# Altium project newlock.PrjPcb
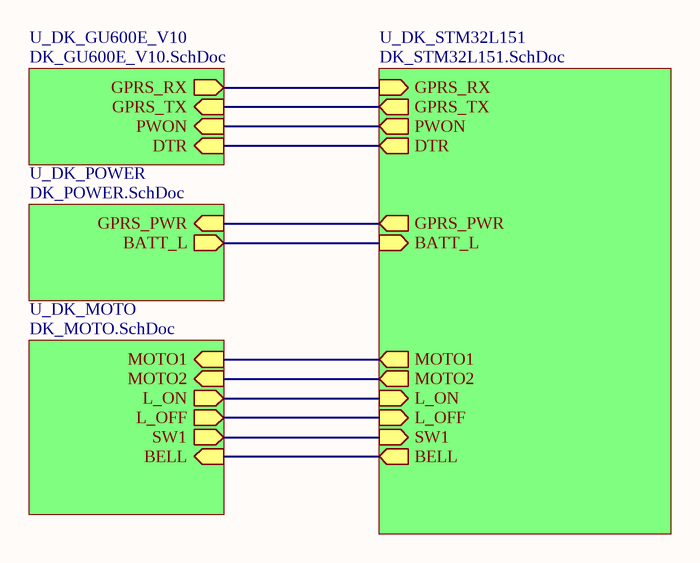
[diagram p0: main.SchDoc]
5 sheets, 86 parts. Net scope: hierarchical (ports join the sheet entries above them; power ports are global).
Board file: DK_LOCK_V1.0.PcbDoc
Sheets:
  main.SchDoc
    U_DK_STM32L151 = DK_STM32L151.SchDoc
    U_DK_POWER = DK_POWER.SchDoc
    U_DK_MOTO = DK_MOTO.SchDoc
    U_DK_GU600E_V10 = DK_GU600E_V10.SchDoc

## Sheet main.SchDoc
size A4

### Sub-sheets
U_DK_GU600E_V10 = DK_GU600E_V10.SchDoc: GPRS_RX (out), GPRS_TX (in), PWON (in), DTR (in)
U_DK_MOTO = DK_MOTO.SchDoc: MOTO1 (in), MOTO2 (in), L_OFF (out), L_ON (out), SW1 (out), BELL (in)
U_DK_POWER = DK_POWER.SchDoc: GPRS_PWR (in), BATT_L (out)
U_DK_STM32L151 = DK_STM32L151.SchDoc: GPRS_TX (out), GPRS_RX (in), PWON (out), GPRS_PWR (out), MOTO1 (out), MOTO2 (out), BATT_L (in), L_ON (in), L_OFF (in), SW1 (in), DTR (out), BELL (out)

### Nets
GPRS_PWR: sheet U_DK_STM32L151/GPRS_PWR, sheet U_DK_POWER/GPRS_PWR
L_OFF: sheet U_DK_STM32L151/L_OFF, sheet U_DK_MOTO/L_OFF
L_ON: sheet U_DK_STM32L151/L_ON, sheet U_DK_MOTO/L_ON
MOTO1: sheet U_DK_STM32L151/MOTO1, sheet U_DK_MOTO/MOTO1
MOTO2: sheet U_DK_STM32L151/MOTO2, sheet U_DK_MOTO/MOTO2
PWON: sheet U_DK_STM32L151/PWON, sheet U_DK_GU600E_V10/PWON
SW1: sheet U_DK_STM32L151/SW1, sheet U_DK_MOTO/SW1
NetR4_1: sheet U_DK_STM32L151/GPRS_TX, sheet U_DK_GU600E_V10/GPRS_TX
NetR5_1: sheet U_DK_STM32L151/GPRS_RX, sheet U_DK_GU600E_V10/GPRS_RX
NetR6_1: sheet U_DK_STM32L151/BATT_L, sheet U_DK_POWER/BATT_L
NetR25_1: sheet U_DK_STM32L151/BELL, sheet U_DK_MOTO/BELL
NetU1_44: sheet U_DK_STM32L151/DTR, sheet U_DK_GU600E_V10/DTR

## Sheet DK_STM32L151.SchDoc: lock
size A4; Author: george; Revision: V1.0; SheetNumber: 1
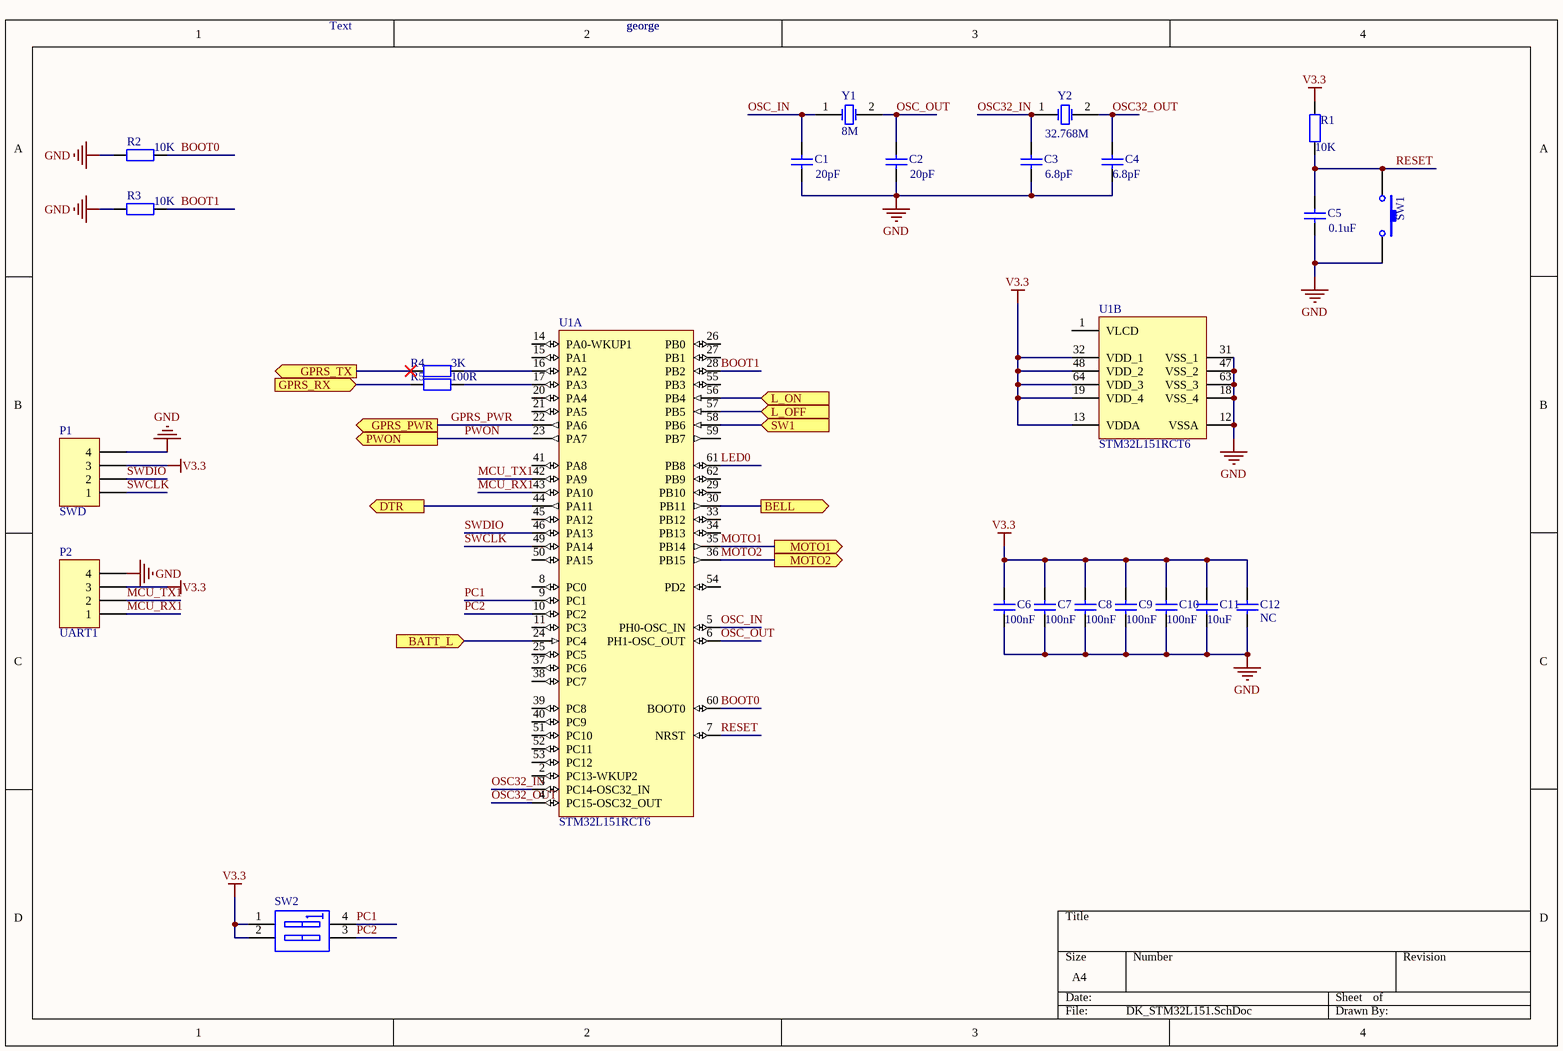
[diagram p1: DK_STM32L151.SchDoc]

### Parts
C1  value 20pF  [0603]  (hidden comment: Cap)
C2  value 20pF  [0603]  (hidden comment: Cap)
C3  value 6.8pF  [0603]  (hidden comment: Cap)
C4  value 6.8pF  [0603]  (hidden comment: Cap)
C5  value 0.1uF  [0603]  (hidden comment: Cap)
C6  value 100nF  [0603]  (hidden comment: Cap)
C7  value 100nF  [0603]  (hidden comment: Cap)
C8  value 100nF  [0603]  (hidden comment: Cap)
C9  value 100nF  [0603]  (hidden comment: Cap)
C10  value 100nF  [0603]  (hidden comment: Cap)
C11  value 10uF  [0603]  (hidden comment: Cap)
C12  NC  [0603]
P1  SWD  [HDR1X4]
P2  UART1  [HDR1X4]
R1  value 10K  [0603]  (hidden comment: Res2)
R2  value 10K  [0603]  (hidden comment: Res2)
R3  value 10K  [0603]  (hidden comment: Res2)
R4  value 3K  [0603]  (hidden comment: Res2)
R5  value 100R  [0603]  (hidden comment: Res2)
SW1  SW-PB  [3*6*4.3]  (value not drawn)
SW2  SW DIP-2  [SW-2*4]  (value not drawn)
U1  STM32L151RCT6  [LQFP64]  (parts A,B of 2)
Y1  8M  [SMT-OSC]
Y2  32.768M  [XTAL32.786]

### Ports
BATT_L (in), BELL (out), DTR (out), GPRS_PWR (out), GPRS_RX (in), GPRS_TX (out), L_OFF (in), L_ON (in), MOTO1 (out), MOTO2 (out), PWON (out), SW1 (in)

### Nets
GND: C1.1 C2.1 C3.1 C4.1 C5.2 C6.1 C7.1 C8.1 C9.1 C10.1 C11.1 C12.1 P1.4 P2.4 R2.1 R3.1 SW1.2 U1.12(VSSA) U1.18(VSS_4) U1.31(VSS_1) U1.47(VSS_2) U1.63(VSS_3)
V3.3: C6.2 C7.2 C8.2 C9.2 C10.2 C11.2 C12.2 P1.3 P2.3 R1.1 SW2.1(A1) SW2.2(A2) U1.13(VDDA) U1.19(VDD_4) U1.32(VDD_1) U1.48(VDD_2) U1.64(VDD_3)
BOOT0: R2.2 U1.60(BOOT0)
BOOT1: R3.2 U1.28(PB2)
GPRS_PWR: U1.22(PA6) ; port GPRS_PWR
L_OFF: U1.57(PB5) ; port L_OFF
L_ON: U1.56(PB4) ; port L_ON
LED0: U1.61(PB8)
MCU_RX1: P2.1 U1.43(PA10)
MCU_TX1: P2.2 U1.42(PA9)
MOTO1: U1.35(PB14) ; port MOTO1
MOTO2: U1.36(PB15) ; port MOTO2
OSC32_IN: C3.2 U1.3(PC14-OSC32_IN) Y2.1(OSC1)
OSC32_OUT: C4.2 U1.4(PC15-OSC32_OUT) Y2.2(OSC2)
OSC_IN: C1.2 U1.5(PH0-OSC_IN) Y1.1(OSC1)
OSC_OUT: C2.2 U1.6(PH1-OSC_OUT) Y1.2(OSC2)
PC1: SW2.4(B1) U1.9(PC1)
PC2: SW2.3(B2) U1.10(PC2)
PWON: U1.23(PA7) ; port PWON
RESET: C5.1 R1.2 SW1.1 U1.7(NRST)
SW1: U1.58(PB6) ; port SW1
SWCLK: P1.1 U1.49(PA14)
SWDIO: P1.2 U1.46(PA13)
NetR4_1: R4.1 ; port GPRS_TX
NetR4_2: R4.2 U1.16(PA2)
NetR5_1: R5.1 ; port GPRS_RX
NetR5_2: R5.2 U1.17(PA3)
NetR6_1: U1.24(PC4) ; port BATT_L
NetR25_1: U1.30(PB11) ; port BELL
NetU1_44: U1.44(PA11) ; port DTR

Not connected (* = marked no-connect by the designer): U1 1(VLCD) 2(PC13-WKUP2) 8(PC0) 11(PC3) 14(PA0-WKUP1) 15(PA1) 20(PA4) 21(PA5) 25(PC5) 26(PB0) 27(PB1) 29(PB10) 33(PB12) 34(PB13) 37(PC6) 38(PC7) 39(PC8) 40(PC9) 41(PA8) 45(PA12) 50(PA15) 51(PC10) 52(PC11) 53(PC12) 54(PD2) 55(PB3) 59(PB7) 62(PB9)

### Notes on the sheet
- Text

### Library data of the parts
C1-C11 = Cap: Capacitor; Published: 8-Jun-2000; LatestRevisionDate: 17-Jul-2002; LatestRevisionNote: Re-released for DXP Platform.; PackageReference: RAD-0.3; Publisher: Altium Limited; PackageDescription: Radial Cap, Thru-Hole; 2 Leads; 0.3 in Pin Spacing
C12 = Cap: Capacitor; Value: 10uF; Published: 8-Jun-2000; LatestRevisionDate: 17-Jul-2002; LatestRevisionNote: Re-released for DXP Platform.; PackageReference: RAD-0.3; Publisher: Altium Limited; PackageDescription: Radial Cap, Thru-Hole; 2 Leads; 0.3 in Pin Spacing
P1 P2 = Header 4: Header, 4-Pin; LatestRevisionDate: 17-Jul-2002; LatestRevisionNote: Re-released for DXP Platform.; Publisher: Altium Limited
R1-R5 = Res2: Resistor; Published: 8-Jun-2000; LatestRevisionDate: 17-Jul-2002; LatestRevisionNote: Re-released for DXP Platform.; PackageReference: AXIAL-0.4; Publisher: Altium Limited; PackageDescription: Axial Device, Thru-Hole; 2 Leads; 0.4 in Pin Spacing
SW1 = SW-PB: Switch; Published: 24-Mar-1999; LatestRevisionDate: 17-Jul-2002; LatestRevisionNote: Re-released for DXP Platform.; PackageReference: SPST-2; Publisher: Altium Limited; PackageDescription: Switch; 2 Leads
SW2 = SW DIP-2: DIP Switch, 2 Position, SPST; Published: 24-Mar-1999; LatestRevisionDate: 17-Jul-2002; LatestRevisionNote: Re-released for DXP Platform.; PackageReference: DIP-4; Publisher: Altium Limited
U1 = STM32L151RCT6: ARM Cortex-M3 32-bit MCU, 256 KB Flash, 32 KB Internal RAM, 51 I/Os, 64-pin LQFP, -40 to 85 degC, Tray; Manufacturer: STMicroelectronics; D/A Converter: 2x12-bit (2 Channel); Data E2PROM nom (B): 8192; FLASH Size (Prog) (kB): 256; I/Os (High Current): 51; Internal RAM Size (kB): 32; Supply Voltage(Vcc) min (V): 1.65; DatasheetVersion: Rev. 3; PackageVersion: Rev. 4, 06/2013; PackageReference: LQFP64; PackageDescription: 64-Pin Low Profile Quad Flat Package, 10 x 10 mm Body, 0.5 mm Pitch; Core: ARM Cortex-M3; Operating Frequency(F) (Processor speed) (MHz): 32; Packing: Tray; Mounting Technology: Surface Mount; PartNumber: STM32L151RCT6; ComponentLink1Description: Manufacturer URL; ComponentLink1URL: http://www.st.com/web/en/home.html; ComponentLink2Description: Datasheet; ComponentLink2URL: http://www.st.com/st-web-ui/static/active/en/resource/technical/document/datasheet/DM00048356.pdf; ComponentLink3Description: Package Specification; ComponentLink3URL: http://www.st.com/st-web-ui/static/active/en/resource/technical/document/datasheet/DM00037051.pdf
Y1 Y2 = XTAL: Crystal Oscillator; Published: 8-Jun-2000; LatestRevisionDate: 17-Jul-2002; LatestRevisionNote: Re-released for DXP Platform.; PackageReference: R38; Publisher: Altium Limited; PackageDescription: Crystal, Thru-Hole; 2 Leads; Body 3.1 x 8.2 mm (Dia.xH)

## Sheet DK_POWER.SchDoc
size A4
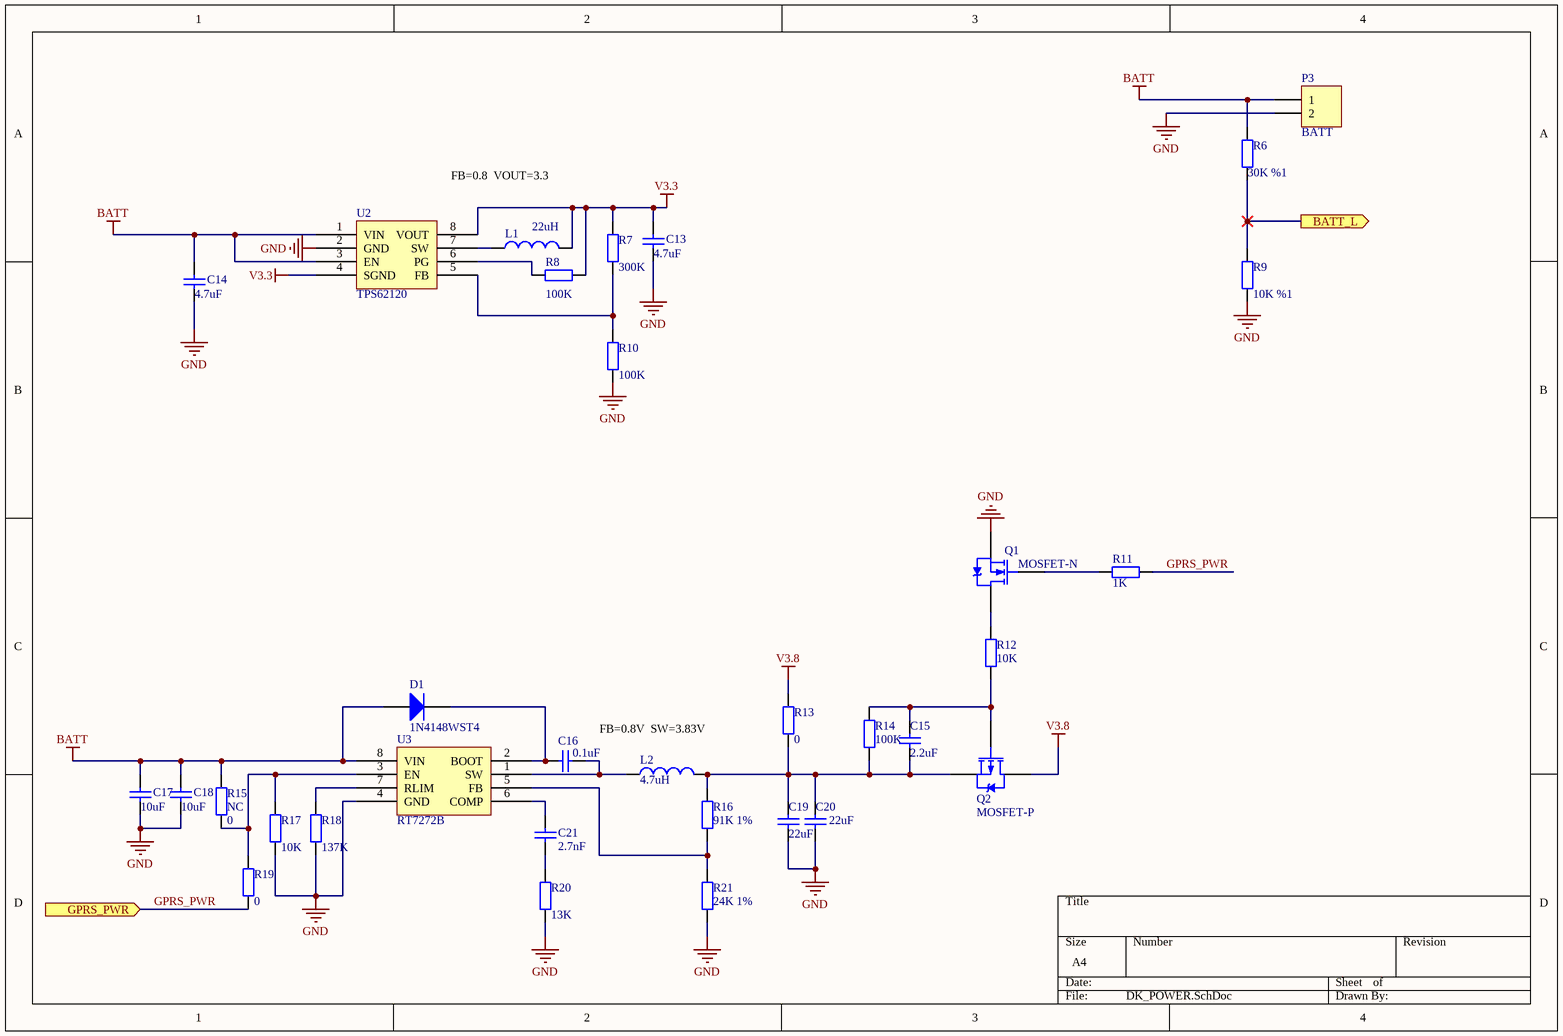
[diagram p2: DK_POWER.SchDoc]

### Parts
C13  value 4.7uF  [0603]  (hidden comment: Cap)
C14  value 4.7uF  [0603]  (hidden comment: Cap)
C15  value 2.2uF  [0603]  (hidden comment: Cap)
C16  value 0.1uF  [0603]  (hidden comment: Cap)
C17  value 10uF  [0603]  (hidden comment: Cap)
C18  value 10uF  [0603]  (hidden comment: Cap)
C19  value 22uF  [0603]  (hidden comment: Cap)
C20  value 22uF  [0603]  (hidden comment: Cap)
C21  value 2.7nF  [0603]  (hidden comment: Cap)
D1  1N4148WST4  [SOD-323]
L1  value 22uH  [0630]  (hidden comment: Inductor)
L2  value 4.7uH  [0630]  (hidden comment: Inductor)
P3  BATT  [HEAD2L-0.8]
Q1  MOSFET-N  [SOT-23A]
Q2  MOSFET-P  [SOT-23A]
R6  value 30K %1  [0603]  (hidden comment: Res2)
R7  value 300K  [0603]  (hidden comment: Res2)
R8  value 100K  [0603]  (hidden comment: Res2)
R9  value 10K %1  [0603]  (hidden comment: Res2)
R10  value 100K  [0603]  (hidden comment: Res2)
R11  value 1K  [0603]  (hidden comment: Res2)
R12  value 10K  [0603]  (hidden comment: Res2)
R13  value 0  [0603]  (hidden comment: NC)
R14  value 100K  [0603]  (hidden comment: Res2)
R15  NC  value 0  [0603]
R16  value 91K 1%  [0603]  (hidden comment: Res2)
R17  value 10K  [0603]  (hidden comment: Res2)
R18  value 137K  [0603]  (hidden comment: Res2)
R19  value 0  [0603]  (hidden comment: Res2)
R20  value 13K  [0603]  (hidden comment: Res2)
R21  value 24K 1%  [0603]  (hidden comment: Res2)
U2  TPS62120  [TPS62120]
U3  RT7272B  [RT7272B]

### Ports
BATT_L (out), GPRS_PWR (in)

### Nets
BATT: C14.2 C17.2 C18.2 D1.1(A) P3.1 R6.2 R15.2 U2.1(VIN) U2.3(EN) U3.8(VIN)
GND: C13.1 C14.1 C17.1 C18.1 C19.1 C20.1 P3.2 Q1.3(S) R9.2 R10.1 R17.1 R18.1 R20.1 R21.1 U2.2(GND) U3.4(GND)
V3.3: C13.2 L1.2 R7.2 R8.2 U2.4(SGND) U2.8(VOUT)
V3.8: Q2.2(D) R13.2
GPRS_PWR: R11.2 R19.1 ; port GPRS_PWR
NetC15_1: C15.1 C19.2 C20.2 L2.2 Q2.3(S) R13.1 R14.1 R16.2
NetC15_2: C15.2 Q2.1(G) R12.1 R14.2
NetC16_1: C16.1 L2.1 U3.1(SW)
NetC16_2: C16.2 D1.2(K) U3.2(BOOT)
NetC21_1: C21.1 U3.6(COMP)
NetC21_2: C21.2 R20.2
NetL1_1: L1.1 U2.7(SW)
NetQ1_1: Q1.1(G) R11.1
NetQ1_2: Q1.2(D) R12.2
NetR6_1: R6.1 R9.1 ; port BATT_L
NetR7_1: R7.1 R10.2 U2.5(FB)
NetR8_1: R8.1 U2.6(PG)
NetR15_1: R15.1 R17.2 R19.2 U3.3(EN)
NetR16_1: R16.1 R21.2 U3.5(FB)
NetR18_2: R18.2 U3.7(RLIM)

### Notes on the sheet
- FB=0.8  VOUT=3.3
- FB=0.8V  SW=3.83V

### Library data of the parts
C13-C21 = Cap: Capacitor; Published: 8-Jun-2000; LatestRevisionDate: 17-Jul-2002; LatestRevisionNote: Re-released for DXP Platform.; PackageReference: RAD-0.3; Publisher: Altium Limited; PackageDescription: Radial Cap, Thru-Hole; 2 Leads; 0.3 in Pin Spacing
D1 = Diode: Default Diode; Published: 8-Jun-2000; LatestRevisionDate: 17-Jul-2002; LatestRevisionNote: Re-released for DXP Platform.; PackageVersion: Sep-1996; PackageReference: SMC; Publisher: Altium Limited; PackageDescription: DO-214-AB/SMC; 2 C-Bend Leads; Body 7.9 x 5.9 mm, inc. leads (LxW); Code_JEDEC: DO-214-AB
L1 L2 = Inductor: Code_IEC: 1005; Published: 8-Jun-2000; LatestRevisionDate: 29-May-2009; LatestRevisionNote: IPC-7351 Footprint Added.; PackageReference: 0402-A; Publisher: Altium Limited; PackageDescription: Chip Inductor; Code_JEITA: 0402
P3 = Header 2: Header, 2-Pin; LatestRevisionDate: 17-Jul-2002; LatestRevisionNote: Re-released for DXP Platform.; Publisher: Altium Limited
Q1 = NMOS-2: N-Channel Power MOSFET; Note: Pin 2 is electrically connected to pin 4.; Published: 8-Jun-2000; LatestRevisionDate: 17-Jul-2002; LatestRevisionNote: Re-released for DXP Platform.; DatasheetVersion: PD-9.814; PackageVersion: Feb-1997; PackageReference: TO-220AB; Publisher: Altium Limited; PackageDescription: TO, Thru-Hole, Vertical, Heatsink Mounted; 3 In-Line Leads; Pitch 2.54 mm; ComponentLink1Description: Manufacturer Link; ComponentLink1URL: http://www.irf.com/
Q2 = PMOS-2: P-Channel Power MOSFET; Note: Pin 4 not drawn and electrically connected to Pin 2.; Published: 8-Jun-2000; LatestRevisionDate: 17-Jul-2002; LatestRevisionNote: Re-released for DXP Platform.; DatasheetVersion: PD-9.390D; PackageVersion: Feb-1997; PackageReference: TO-220AB; Publisher: Altium Limited; PackageDescription: TO, Thru-Hole, Vertical, Heatsink Mounted; 3 In-Line Leads; Pitch 2.54 mm; ComponentLink1Description: Manufacturer Link; ComponentLink1URL: http://www.irf.com/
R6-R21 = Res2: Resistor; Published: 8-Jun-2000; LatestRevisionDate: 17-Jul-2002; LatestRevisionNote: Re-released for DXP Platform.; PackageReference: AXIAL-0.4; Publisher: Altium Limited; PackageDescription: Axial Device, Thru-Hole; 2 Leads; 0.4 in Pin Spacing

## Sheet DK_MOTO.SchDoc
size A4
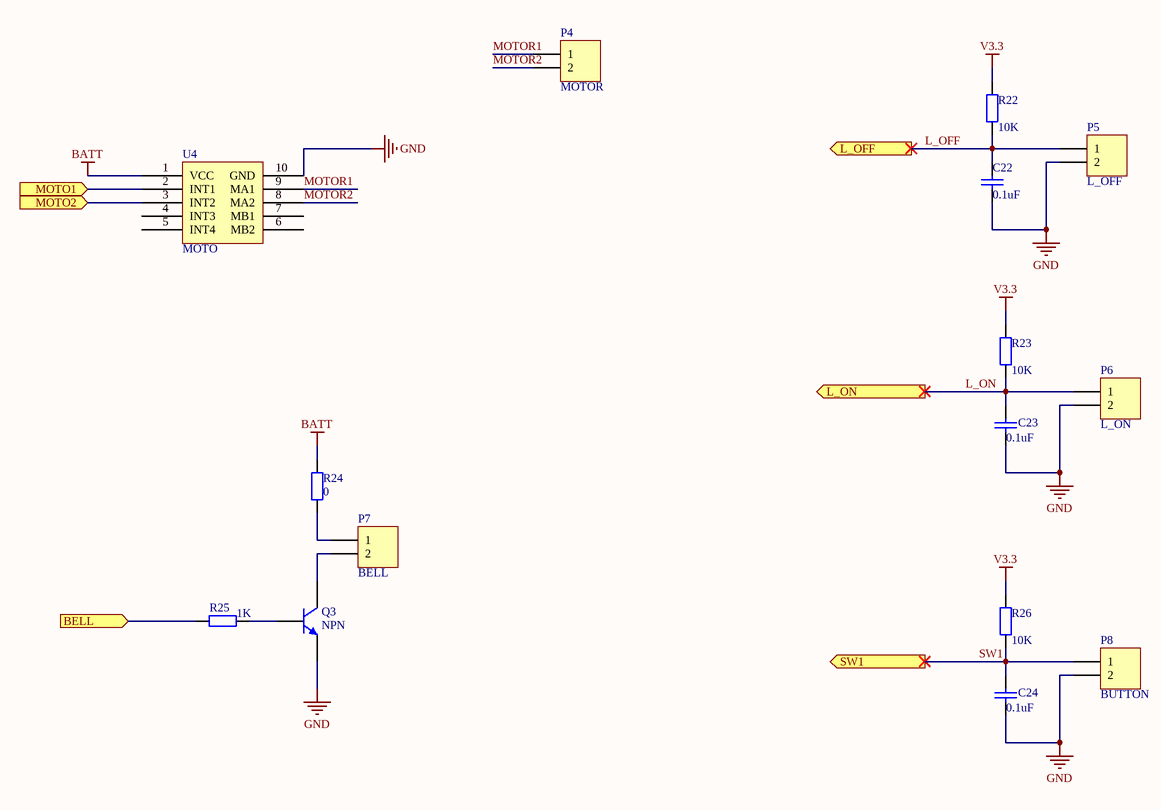
[diagram p3: DK_MOTO.SchDoc]

### Parts
C22  value 0.1uF  [0603]  (hidden comment: Cap)
C23  value 0.1uF  [0603]  (hidden comment: Cap)
C24  value 0.1uF  [0603]  (hidden comment: Cap)
P4  MOTOR  [COM2]
P5  L_OFF  [COM2]
P6  L_ON  [COM2]
P7  BELL  [COM2]
P8  BUTTON  [COM2]
Q3  NPN  [SOT-23A]
R22  value 10K  [0603]  (hidden comment: Res2)
R23  value 10K  [0603]  (hidden comment: Res2)
R24  value 0  [0603]  (hidden comment: Res2)
R25  value 1K  [0603]  (hidden comment: Res2)
R26  value 10K  [0603]  (hidden comment: Res2)
U4  MOTO  [MOTO2]

### Ports
BELL (in), L_OFF (out), L_ON (out), MOTO1 (in), MOTO2 (in), SW1 (out)

### Nets
BATT: R24.2 U4.1(VCC)
GND: C22.1 C23.1 C24.1 P5.2 P6.2 P8.2 Q3.3(E) U4.10(GND)
V3.3: R22.2 R23.2 R26.2
L_OFF: C22.2 P5.1 R22.1 ; port L_OFF
L_ON: C23.2 P6.1 R23.1 ; port L_ON
MOTO1: U4.2(INT1) ; port MOTO1
MOTO2: U4.3(INT2) ; port MOTO2
MOTOR1: P4.1 U4.9(MA1)
MOTOR2: P4.2 U4.8(MA2)
SW1: C24.2 P8.1 R26.1 ; port SW1
NetP7_1: P7.1 R24.1
NetP7_2: P7.2 Q3.1(C)
NetQ3_2: Q3.2(B) R25.2
NetR25_1: R25.1 ; port BELL

Not connected (* = marked no-connect by the designer): U4 4(INT3) 5(INT4) 6(MB2) 7(MB1)

### Library data of the parts
C22-C24 = Cap: Capacitor; Published: 8-Jun-2000; LatestRevisionDate: 17-Jul-2002; LatestRevisionNote: Re-released for DXP Platform.; PackageReference: RAD-0.3; Publisher: Altium Limited; PackageDescription: Radial Cap, Thru-Hole; 2 Leads; 0.3 in Pin Spacing
P4-P8 = Header 2: Header, 2-Pin; LatestRevisionDate: 17-Jul-2002; LatestRevisionNote: Re-released for DXP Platform.; Publisher: Altium Limited
Q3 = NPN: NPN Bipolar Transistor; Published: 8-Jun-2000; LatestRevisionDate: 17-Jul-2002; LatestRevisionNote: Re-released for DXP Platform.; PackageReference: TO-226-AA; Publisher: Altium Limited; PackageDescription: TO, Flat Index; 3 In-Line, Axial Leads; Body Dia. 4.8mm; Leads 0.55 x 0.51 mm (max); Code_JEDEC: TO-226-AA
R22-R26 = Res2: Resistor; Published: 8-Jun-2000; LatestRevisionDate: 17-Jul-2002; LatestRevisionNote: Re-released for DXP Platform.; PackageReference: AXIAL-0.4; Publisher: Altium Limited; PackageDescription: Axial Device, Thru-Hole; 2 Leads; 0.4 in Pin Spacing

## Sheet DK_GU600E_V10.SchDoc
size A4
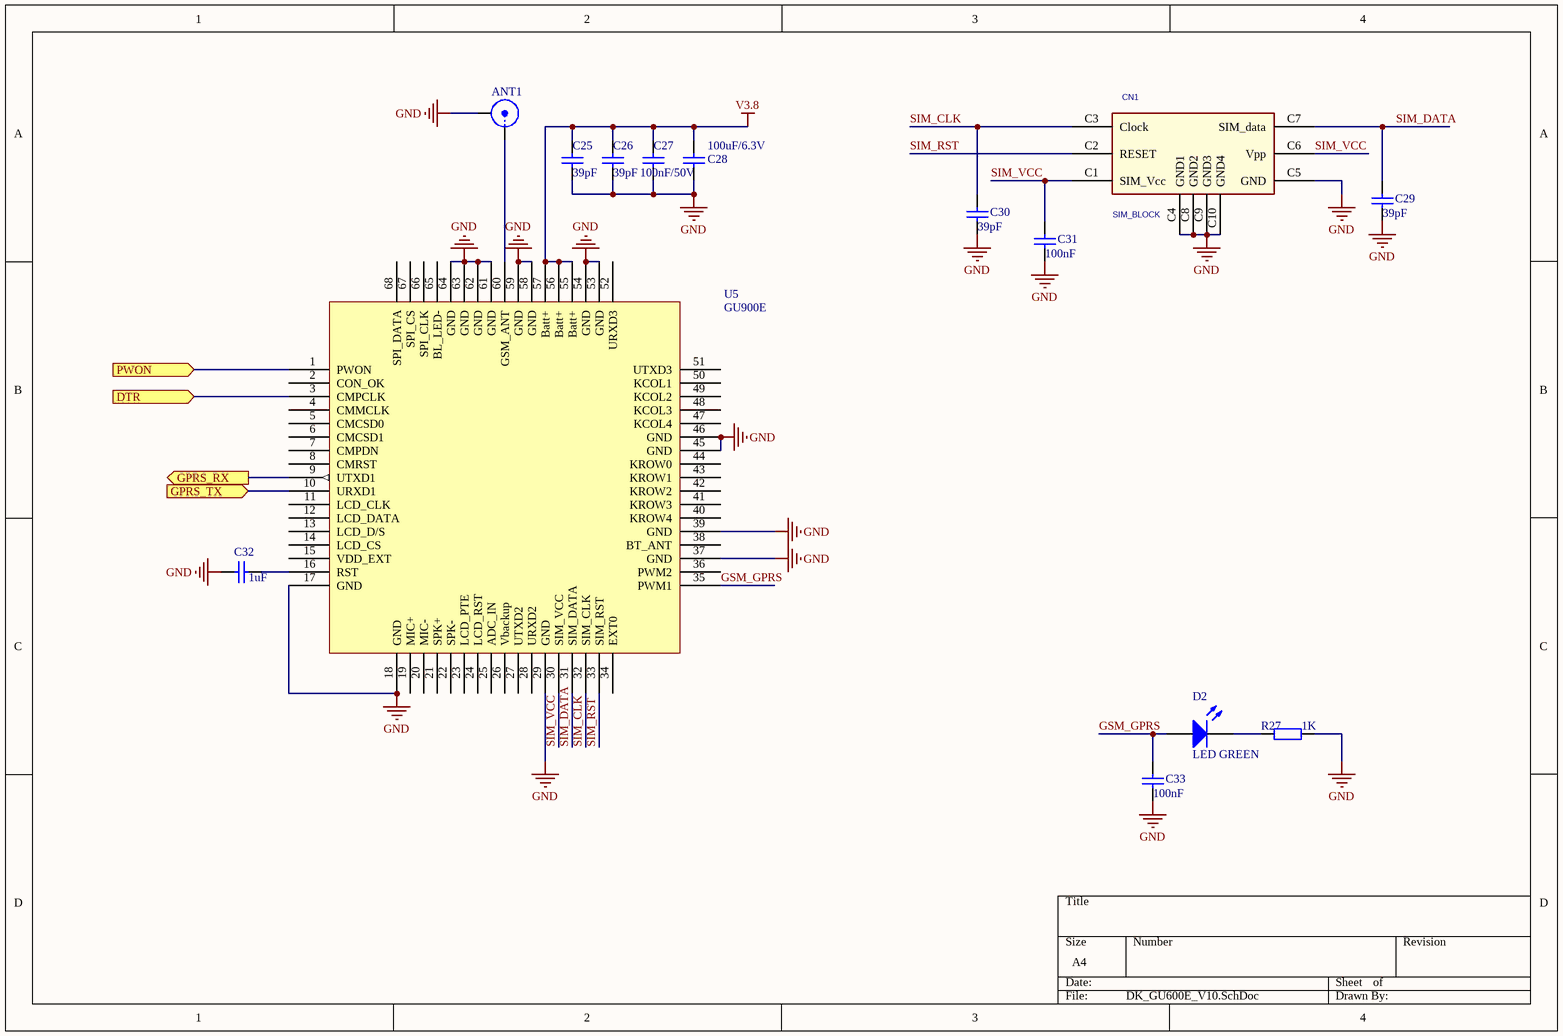
[diagram p4: DK_GU600E_V10.SchDoc]

### Parts
ANT1  SMB  [SMB_V-RJ45]  (value not drawn)
C25  value 39pF  [0603]  (hidden comment: Cap)
C26  value 39pF  [0603]  (hidden comment: Cap)
C27  value 100nF/50V  [0603]  (hidden comment: Cap)
C28  value 100uF/6.3V  [1206]  (hidden comment: Cap)
C29  value 39pF  [0603]  (hidden comment: Cap)
C30  value 39pF  [0603]  (hidden comment: Cap)
C31  value 100nF  [0603]  (hidden comment: Cap)
C32  value 1uF  [0603]  (hidden comment: Cap)
C33  value 100nF  [0603]  (hidden comment: Cap)
CN1  SIM_BLOCK  [SIM_BLOCK]
D2  LED GREEN  [LED0603]
R27  value 1K  [0603]  (hidden comment: Res2)
U5  GU900E  [SIM900-68P]

### Ports
DTR (in), GPRS_RX (out), GPRS_TX (in), PWON (in)

### Nets
GND: ANT1.2(Y) C25.1 C26.1 C27.1 C28.1 C29.1 C30.1 C31.1 C32.1 C33.1 CN1.C4(GND1) CN1.C5(GND) CN1.C8(GND2) CN1.C9(GND3) CN1.C10(GND4) R27.2 U5.17(GND) U5.18(GND) U5.29(GND) U5.37(GND) U5.39(GND) U5.45(GND) U5.46(GND) U5.53(GND) U5.54(GND) U5.58(GND) U5.59(GND) U5.61(GND) U5.62(GND) U5.63(GND) U5.64(GND)
V3.8: C25.2 C26.2 C27.2 C28.2 U5.55(Batt+) U5.56(Batt+) U5.57(Batt+)
GSM_GPRS: C33.2 D2.1(A) U5.35(PWM1)
PWON: U5.1(PWON) ; port PWON
SIM_CLK: C30.2 CN1.C3(Clock) U5.32(SIM_CLK)
SIM_DATA: C29.2 CN1.C7(SIM_data) U5.31(SIM_DATA)
SIM_RST: CN1.C2(RESET) U5.33(SIM_RST)
SIM_VCC: C31.2 CN1.C1(SIM_Vcc) CN1.C6(Vpp) U5.30(SIM_VCC)
NetANT1_1: ANT1.1(X) U5.60(GSM_ANT)
NetC32_2: C32.2 U5.16(RST)
NetD2_2: D2.2(K) R27.1
NetR4_1: U5.10(URXD1) ; port GPRS_TX
NetR5_1: U5.9(UTXD1) ; port GPRS_RX
NetU1_44: U5.3(CMPCLK) ; port DTR

Not connected (* = marked no-connect by the designer): U5 2(CON_OK) 4(CMMCLK) 5(CMCSD0) 6(CMCSD1) 7(CMPDN) 8(CMRST) 11(LCD_CLK) 12(LCD_DATA) 13(LCD_D/S) 14(LCD_CS) 15(VDD_EXT) 19(MIC+) 20(MIC-) 21(SPK+) 22(SPK-) 23(LCD_PTE) 24(LCD_RST) 25(ADC_IN) 26(Vbackup) 27(UTXD2) 28(URXD2) 34(EXT0) 36(PWM2) 38(BT_ANT) 40(KROW4) 41(KROW3) 42(KROW2) 43(KROW1) 44(KROW0) 47(KCOL4) 48(KCOL3) 49(KCOL2) 50(KCOL1) 51(UTXD3) 52(URXD3) 65(BL_LED-) 66(SPI_CLK) 67(SPI_CS) 68(SPI_DATA)

### Library data of the parts
ANT1 = SMB: SMB Straight Connector; LatestRevisionDate: 17-Jul-2002; LatestRevisionNote: Re-released for DXP Platform.; Publisher: Altium Limited
C25-C33 = Cap: Capacitor; Published: 8-Jun-2000; LatestRevisionDate: 17-Jul-2002; LatestRevisionNote: Re-released for DXP Platform.; PackageReference: RAD-0.3; Publisher: Altium Limited; PackageDescription: Radial Cap, Thru-Hole; 2 Leads; 0.3 in Pin Spacing
CN1 = SIM_BLOCK_2
D2 = LED2: Typical RED, GREEN, YELLOW, AMBER GaAs LED; Published: 8-Jun-2000; LatestRevisionDate: 17-Jul-2002; LatestRevisionNote: Re-released for DXP Platform.; PackageVersion: Feb-2002; PackageReference: 3.2X1.6X1.1; Publisher: Altium Limited; PackageDescription: SM LED; 2 Flat Leads
R27 = Res2: Resistor; Published: 8-Jun-2000; LatestRevisionDate: 17-Jul-2002; LatestRevisionNote: Re-released for DXP Platform.; PackageReference: AXIAL-0.4; Publisher: Altium Limited; PackageDescription: Axial Device, Thru-Hole; 2 Leads; 0.4 in Pin Spacing

## Nets that join several sheets
BATT: DK_POWER (10 pins), DK_MOTO (R24.2 U4.1)
GND: DK_STM32L151 (22 pins), DK_POWER (16 pins), DK_MOTO (8 pins), DK_GU600E_V10 (31 pins)
V3.3: DK_STM32L151 (17 pins), DK_POWER (6 pins), DK_MOTO (R22.2 R23.2 R26.2)
V3.8: DK_POWER (Q2.2 R13.2), DK_GU600E_V10 (7 pins)
GPRS_PWR: DK_STM32L151 (U1.22), DK_POWER (R11.2 R19.1)
L_OFF: DK_STM32L151 (U1.57), DK_MOTO (C22.2 P5.1 R22.1)
L_ON: DK_STM32L151 (U1.56), DK_MOTO (C23.2 P6.1 R23.1)
MOTO1: DK_STM32L151 (U1.35), DK_MOTO (U4.2)
MOTO2: DK_STM32L151 (U1.36), DK_MOTO (U4.3)
NetR4_1: DK_STM32L151 (R4.1), DK_GU600E_V10 (U5.10)
NetR5_1: DK_STM32L151 (R5.1), DK_GU600E_V10 (U5.9)
NetR6_1: DK_STM32L151 (U1.24), DK_POWER (R6.1 R9.1)
NetR25_1: DK_STM32L151 (U1.30), DK_MOTO (R25.1)
NetU1_44: DK_STM32L151 (U1.44), DK_GU600E_V10 (U5.3)
PWON: DK_STM32L151 (U1.23), DK_GU600E_V10 (U5.1)
SW1: DK_STM32L151 (U1.58), DK_MOTO (C24.2 P8.1 R26.1)